# Altium schematic sheet Status.SchDoc: Status LEDs / Test Points
size A4; Date: 06.10.2023; ApprovedBy: M.Sc. Tobias Wirth; CheckedBy: M.Sc. Tobias Wirth; Author: M.Sc. Tobias Wirth; CompanyName: University of Stuttgart; DrawnBy: M.Sc. Tobias Wirth; Engineer: M.Sc. Tobias Wirth; Organization: IIS; Address1: Pfaffenwaldring 47; Address2: 70569 Stuttgart; Revision: V1.2; SheetNumber: 13; SheetTotal: 17; ProjectNameAlt: AUS - NMR System; Time: 21:30; ImagePath: N/A; Application_BuildNumber: N/A
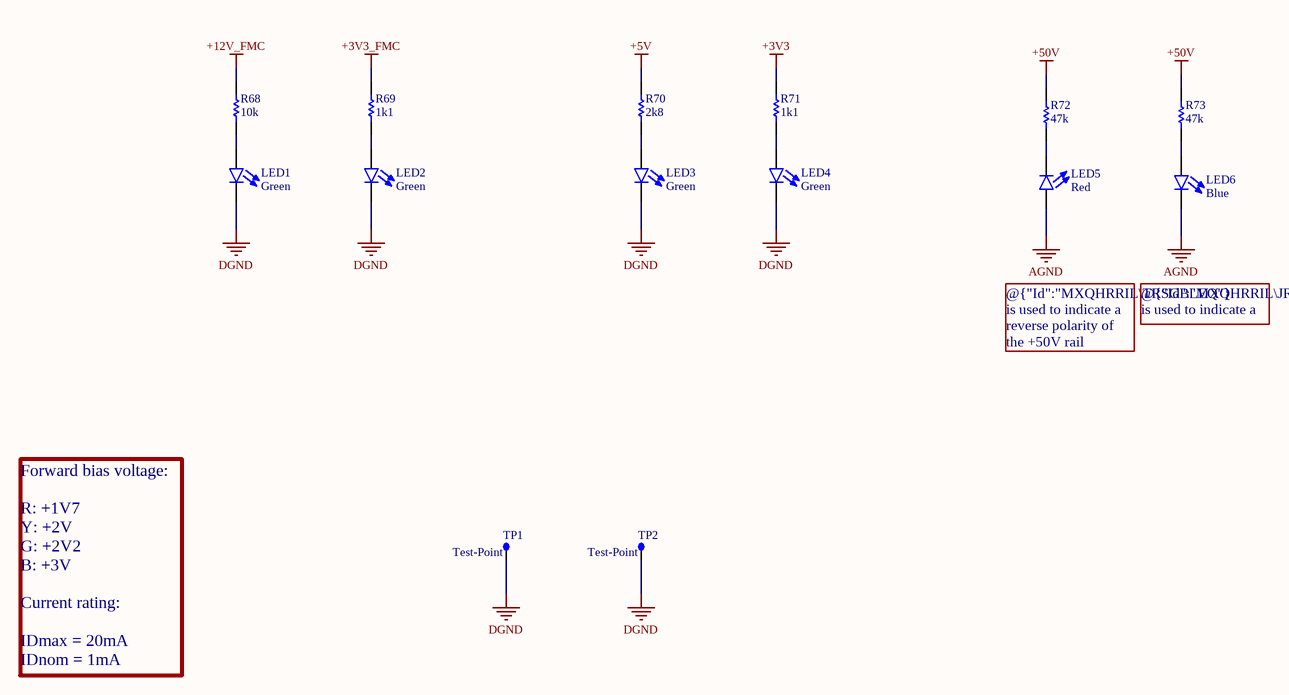
[diagram p0: Status.SchDoc]

## Parts
LED1  Green  [RES_0603]
LED2  Green  [RES_0603]
LED3  Green  [RES_0603]
LED4  Green  [RES_0603]
LED5  Red  [RES_0603]
LED6  Blue  [RES_0603]
R68  10k  [RES_0402]
R69  1k1  [RES_0402]
R70  2k8  [RES_0402]
R71  1k1  [RES_0402]
R72  47k  [RES_0402]
R73  47k  [RES_0402]
TP1  Test-Point  [Test-Point-2]
TP2  Test-Point  [Test-Point-2]

## Nets
+3V3: R71.2
+3V3_FMC: R69.2
+5V: R70.2
+12V_FMC: R68.2
+50V: R72.2 R73.2
AGND: LED5.1 LED6.2
DGND: LED1.2 LED2.2 LED3.2 LED4.2 TP1.1(TP) TP2.1(TP)
NetLED1_1: LED1.1 R68.1
NetLED2_1: LED2.1 R69.1
NetLED3_1: LED3.1 R70.1
NetLED4_1: LED4.1 R71.1
NetLED5_2: LED5.2 R72.1
NetLED6_1: LED6.1 R73.1

## Notes on the sheet
- @{"Id":"MXQHRRIL\TRSGBLEQ"} is used to indicate a reverse polarity of the +50V rail
- @{"Id":"MXQHRRIL\JRXIIWLO"} is used to indicate a live +50V
- Forward bias voltage:
  R: +1V7
  Y: +2V
  G: +2V2
  B: +3V
  Current rating:
  IDmax = 20mA
  IDnom = 1mA
- Title
- Size
- Date:
- Sheet
- A4
- of
- Project
- Drawn By:
- Revision:

## Library data of the parts
LED1-LED6 = LED
R68-R73 = Res: Part Number: *; Supplier: *
  R68: Value: 10k
  R69 R71: Value: 1k1
  R70: Value: 2k8
  R72 R73: Value: 47k
TP1 TP2 = Test-Point: Generic Test Point; Supplier 1: Digi-Key; Supplier Part Number 1: 36-5016CT-ND